# EAGLE design rc_car_v3 (EAGLE 9.3.2)
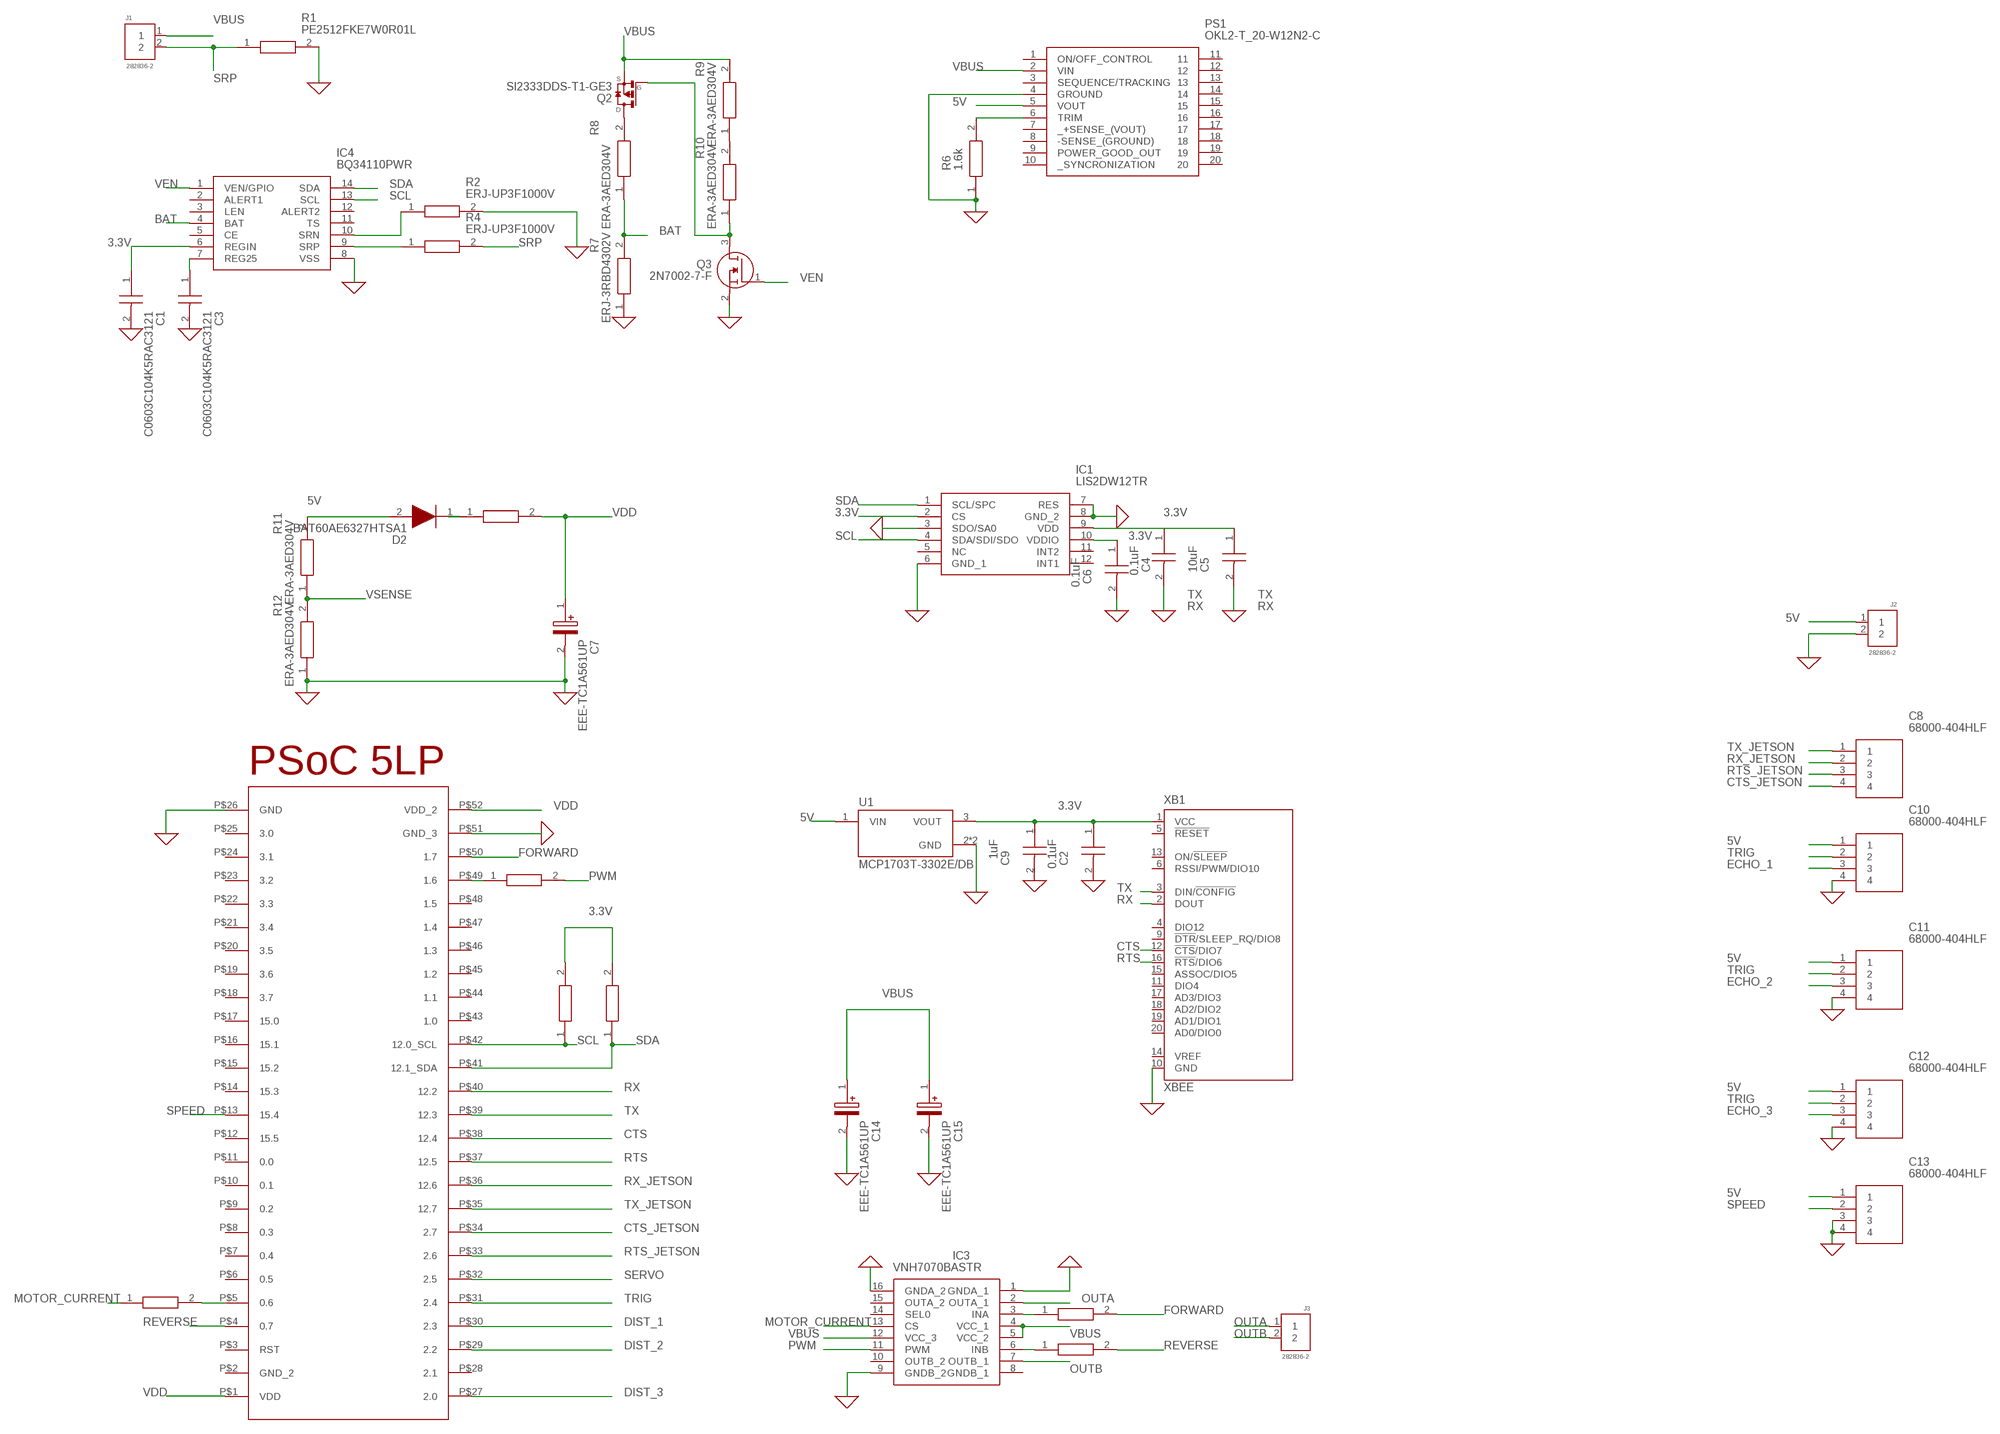
[diagram p0: schematic, sheet 1]

## Parts
C1  C0603C104K5RAC3121  [CAPC1608X95N]
C2  0.1uF  C0603C104K5RAC3121  [CAPC1608X95N]
C3  C0603C104K5RAC3121  [CAPC1608X95N]
C4  0.1uF  C0603C104K5RAC3121  [CAPC1608X95N]
C5  10uF  C0603C104K5RAC3121  [CAPC1608X95N]
C6  0.1uF  C0603C104K5RAC3121  [CAPC1608X95N]
C7  EEE-TC1A561UP  [CAPAE830X1050N]
C8  68000-404HLF  [HDRV4W90P0X254_1X4_1016X241X85]
C9  1uF  C0603C104K5RAC3121  [CAPC1608X95N]
C10  68000-404HLF  [HDRV4W90P0X254_1X4_1016X241X85]
C11  68000-404HLF  [HDRV4W90P0X254_1X4_1016X241X85]
C12  68000-404HLF  [HDRV4W90P0X254_1X4_1016X241X85]
C13  68000-404HLF  [HDRV4W90P0X254_1X4_1016X241X85]
C14  EEE-TC1A561UP  [CAPAE830X1050N]
C15  EEE-TC1A561UP  [CAPAE830X1050N]
D2  BAT60AE6327HTSA1  [SOD2513X110N]
IC1  LIS2DW12TR  [LGA-12]
IC3  VNH7070BASTR  [SOIC127P600X175-16N]
IC4  BQ34110PWR  [SOP65P640X120-14N]
J1  282836-2  [CONN_282836-2]
J2  282836-2  [CONN_282836-2]
J3  282836-2  [CONN_282836-2]
PS1  OKL2-T_20-W12N2-C  [OKL2T20W12N2C]
PSOC1  PSOC_5LP  [PSOC]
Q2  SI2333DDS-T1-GE3  [SOT23]
Q3  2N7002-7-F  [SOT96P240X120-3N]
R1  PE2512FKE7W0R01L  [RESC6432X89N]
R2  ERJ-UP3F1000V  [RESC1608X55N]
R3  1k  ERJ-UP3F1000V  [RESC1608X55N]
R4  ERJ-UP3F1000V  [RESC1608X55N]
R5  1k  ERJ-UP3F1000V  [RESC1608X55N]
R6  1.6k  ERA-3AED304V  [ERA3AEB101V]
R7  ERJ-3RBD4302V  [RESC1608X55N]
R8  ERA-3AED304V  [ERA3AEB101V]
R9  ERA-3AED304V  [ERA3AEB101V]
R10  ERA-3AED304V  [ERA3AEB101V]
R11  ERA-3AED304V  [ERA3AEB101V]
R12  ERA-3AED304V  [ERA3AEB101V]
R13  1k  ERJ-UP3F1000V  [RESC1608X55N]
R14  1k  ERJ-UP3F1000V  [RESC1608X55N]
R15  1k  ERJ-UP3F1000V  [RESC1608X55N]
R16  1k  ERJ-UP3F1000V  [RESC1608X55N]
R17  1k  ERJ-UP3F1000V  [RESC1608X55N]
U1  MCP1703T-3302E/DB  [SOT230P700X180-4N]
XB1  XBEE  [XBEE]

## Nets
0: C1.2 C2.2 C3.2 C4.2 C5.2 C6.2 C7.2(-) C9.2 C10.4 C11.4 C12.4 C13.3 C13.4 C14.2(-) C15.2(-) IC1.3(SDO/SA0) IC1.6(GND_1) IC1.7(RES) IC1.8(GND_2) IC3.1(GNDA_1) IC3.9(GNDB_2) IC3.16(GNDA_2) IC4.8(VSS) PS1.4(GROUND) PSOC1.P$26(GND) PSOC1.P$51(GND_3) Q3.2(S) R1.2 R2.2 R6.1 R7.1 R12.1 U1.2(GND) U1.4(GND) XB1.10(GND) ; supply symbol labelled GND
3.3V: C1.1 C2.1 C4.1 C5.1 C6.1 C9.1 IC1.2(CS) IC1.9(VDD) IC1.10(VDDIO) IC4.6(REGIN) R3.2 R5.2 U1.3(VOUT) XB1.1(VCC)
5V: C10.1 C11.1 C12.1 C13.1 D2.2(A) J2.1 PS1.5(VOUT) R11.2 U1.1(VIN)
BAT: IC4.4(BAT) R7.2 R8.1
CTS: PSOC1.P$38(12.4) XB1.12(!CTS!/DIO7)
CTS_JETSON: C8.4 PSOC1.P$34(2.7)
DIST_1: PSOC1.P$30(2.3)
DIST_2: PSOC1.P$29(2.2)
DIST_3: PSOC1.P$27(2.0)
ECHO_1: C10.3
ECHO_2: C11.3
ECHO_3: C12.3
FORWARD: PSOC1.P$50(1.7) R13.2
MOTOR_CURRENT: IC3.13(CS) R16.1
N$1: PS1.6(TRIM) R6.2
N$2: R9.1 R10.2
N$3: IC4.10(SRN) R2.1
N$4: IC4.9(SRP) R4.1
N$5: C3.1 IC4.7(REG25)
N$6: Q2.3(D) R8.2
N$7: PSOC1.P$49(1.6) R14.1
N$8: Q2.1(G) Q3.3(D) R10.1
N$9: D2.1(K) R17.1
N$10: IC3.3(INA) R13.1
N$11: IC3.6(INB) R15.1
N$13: J2.2 ; supply symbol labelled GND
OUTA: IC3.2(OUTA_1) J3.1
OUTB: IC3.7(OUTB_1) J3.2
PWM: IC3.11(PWM) R14.2
PWM1: PSOC1.P$5(0.6) R16.2
REVERSE: PSOC1.P$4(0.7) R15.2
RTS: PSOC1.P$37(12.5) XB1.16(!RTS!/DIO6)
RTS_JETSON: C8.3 PSOC1.P$33(2.6)
RX: PSOC1.P$40(12.2) XB1.2(DOUT)
RX_JETSON: C8.2 PSOC1.P$36(12.6)
SCL: IC1.4(SDA/SDI/SDO) IC4.13(SCL) PSOC1.P$42(12.0_SCL) R3.1
SDA: IC1.1(SCL/SPC) IC4.14(SDA) PSOC1.P$41(12.1_SDA) R5.1
SERVO: PSOC1.P$32(2.5)
SPEED: C13.2 PSOC1.P$13(15.4)
SRP: J1.2 R1.1 R4.2
TRIG: C10.2 C11.2 C12.2 PSOC1.P$31(2.4)
TX: PSOC1.P$39(12.3) XB1.3(DIN/!CONFIG)
TX_JETSON: C8.1 PSOC1.P$35(12.7)
VBUS: C14.1(+) C15.1(+) IC3.4(VCC_1) IC3.5(VCC_2) IC3.12(VCC_3) J1.1 PS1.2(VIN) Q2.2(S) R9.2
VDD: C7.1(+) PSOC1.P$1(VDD) PSOC1.P$52(VDD_2) R17.2
VEN: IC4.1(VEN/GPIO) Q3.1(G)
VSENSE: R11.1 R12.2
Unconnected: IC1.5(NC) IC1.11(INT2) IC1.12(INT1) IC3.10(OUTB_2) IC3.14(SEL0) IC3.15(OUTA_2) IC4.2(ALERT1) IC4.3(LEN) IC4.5(CE) IC4.11(TS) IC4.12(ALERT2) PS1.1(ON/OFF_CONTROL) PS1.3(SEQUENCE/TRACKING) PS1.7(_+SENSE_(VOUT)) PS1.8(-SENSE_(GROUND)) PS1.9(POWER_GOOD_OUT) PS1.10(_SYNCRONIZATION) PS1.11 PS1.12 PS1.13 PS1.14 PS1.15 PS1.16 PS1.17 PS1.18 PS1.19 PS1.20 PSOC1.P$2(GND_2) PSOC1.P$3(RST) PSOC1.P$6(0.5) PSOC1.P$7(0.4) PSOC1.P$8(0.3) PSOC1.P$9(0.2) PSOC1.P$10(0.1) PSOC1.P$11(0.0) PSOC1.P$12(15.5) PSOC1.P$14(15.3) PSOC1.P$15(15.2) PSOC1.P$16(15.1) PSOC1.P$17(15.0) PSOC1.P$18(3.7) PSOC1.P$19(3.6) PSOC1.P$20(3.5) PSOC1.P$21(3.4) PSOC1.P$22(3.3) PSOC1.P$23(3.2) PSOC1.P$24(3.1) PSOC1.P$25(3.0) PSOC1.P$28(2.1) PSOC1.P$43(1.0) PSOC1.P$44(1.1) PSOC1.P$45(1.2) PSOC1.P$46(1.3) PSOC1.P$47(1.4) PSOC1.P$48(1.5) XB1.4(DIO12) XB1.5(!RESET) XB1.6(RSSI/PWM/DIO10) XB1.9(!DTR!/SLEEP_RQ/DIO8) XB1.11(DIO4) XB1.13(ON/!SLEEP) XB1.14(VREF) XB1.15(ASSOC/DIO5) XB1.17(AD3/DIO3) XB1.18(AD2/DIO2) XB1.19(AD1/DIO1) XB1.20(AD0/DIO0)

## Power pins joined to a net without a drawn wire
GNDB_1: IC3.8(GNDB_1)

## Library data of the parts
C1-C6 C9 = SamacSys_Parts:C0603C104K5RAC3121: Multilayer Ceramic Capacitors MLCC - SMD/SMT 50V .1uF X7R 0603 10% AEC-Q200 Source: Datasheet; DESCRIPTION: Multilayer Ceramic Capacitors MLCC - SMD/SMT 50V .1uF X7R 0603 10% AEC-Q200; HEIGHT: 0.95mm; MANUFACTURER_NAME: Kemet; MANUFACTURER_PART_NUMBER: C0603C104K5RAC3121; MOUSER_PART_NUMBER: 80-C603C104K5RAC3121; MOUSER_PRICE-STOCK: https://www.mouser.co.uk/ProductDetail/KEMET/C0603C104K5RAC3121?qs=oBCMsStVSxe1EkGyoyETtg%3D%3D
C7 C14 C15 = SamacSys_Parts:EEE-TC1A561UP: Cap Aluminum Lytic 560uF 10V 20% (8 X 10.2mm) SMD 0.2 Ohm 410mA 3000h 125C T/R Source: Datasheet <https://www.arrow.com/en/products/eee-tc1a561up/panasonic>; DESCRIPTION: Cap Aluminum Lytic 560uF 10V 20% (8 X 10.2mm) SMD 0.2 Ohm 410mA 3000h 125C T/R; HEIGHT: 10.5mm; MANUFACTURER_NAME: Panasonic; MANUFACTURER_PART_NUMBER: EEE-TC1A561UP
C8 C10-C13 = SamacSys_Parts:68000-404HLF: 4 Positions Header Connector 0.100" (2.54mm) Through Hole Tin Source: Datasheet <http://www.amphenol-icc.com/bergstik-68000404hlf.html>; DESCRIPTION: 4 Positions Header Connector 0.100" (2.54mm) Through Hole Tin; HEIGHT: 8.58mm; MANUFACTURER_NAME: Amphenol; MANUFACTURER_PART_NUMBER: 68000-404HLF; MOUSER_PART_NUMBER: 649-68000-404HLF; MOUSER_PRICE-STOCK: https://www.mouser.co.uk/ProductDetail/Amphenol-FCI/68000-404HLF?qs=p7Li5uGGkArjDZZRBMcFJQ%3D%3D
D2 = SamacSys_Parts:BAT60AE6327HTSA1: INFINEON - BAT60AE6327HTSA1 - RECTIFIER, SCHOTTKY, 3A, 10V, SOD-323 Source: Datasheet <https://www.infineon.com/dgdl/Infineon-BAT60ASERIES-DS-v01_01-en.pdf?fileId=db3a304313d846880113def70c9304a9>; DESCRIPTION: INFINEON - BAT60AE6327HTSA1 - RECTIFIER, SCHOTTKY, 3A, 10V, SOD-323; HEIGHT: 1.1mm; MANUFACTURER_NAME: Infineon; MANUFACTURER_PART_NUMBER: BAT60AE6327HTSA1; MOUSER_PART_NUMBER: 726-BAT60AE6327HTSA1; MOUSER_PRICE-STOCK: https://www.mouser.co.uk/ProductDetail/Infineon-Technologies/BAT60AE6327HTSA1?qs=OwbwYO03UsIW3Y2lCXbs8Q%3D%3D
IC1 = SamacSys_Parts:LIS2DW12TR: Accelerometers MEMS digital output motion sensor:high-performance ultra-low-power 3-axis "femto" accelerometer Source: Datasheet <http://www.st.com/content/ccc/resource/technical/document/datasheet/group3/30/3a/4e/6b/68/16/4a/35/DM00323179/files/DM00323179.pdf/jcr:content/translations/en.DM00323179.pdf>; DESCRIPTION: Accelerometers MEMS digital output motion sensor:high-performance ultra-low-power 3-axis "femto" accelerometer; HEIGHT: mm; MANUFACTURER_NAME: STMicroelectronics; MANUFACTURER_PART_NUMBER: LIS2DW12TR; MOUSER_PART_NUMBER: 511-LIS2DW12TR; MOUSER_PRICE-STOCK: https://www.mouser.co.uk/ProductDetail/STMicroelectronics/LIS2DW12TR?qs=u4fy%2FsgLU9NZAt0DqrAehA%3D%3D
IC3 = SamacSys_Parts:VNH7070BASTR: Motor / Motion / Ignition Controllers & Drivers Automotive fully integrated H-bridge motor driver Source: Datasheet <https://rs.componentsearchengine.com/Datasheets/1/VNH7070BASTR.pdf>; DESCRIPTION: Motor / Motion / Ignition Controllers & Drivers Automotive fully integrated H-bridge motor driver; HEIGHT: 1.75mm; MANUFACTURER_NAME: STMicroelectronics; MANUFACTURER_PART_NUMBER: VNH7070BASTR; MOUSER_PART_NUMBER: 511-VNH7070BASTR; MOUSER_PRICE-STOCK: https://www.mouser.co.uk/ProductDetail/STMicroelectronics/VNH7070BASTR?qs=5aG0NVq1C4zvEdklLjnXpw%3D%3D
IC4 = SamacSys_Parts:BQ34110PWR: Battery Management Multi-Chemistry High-cell Count Battery Fuel Gauge w/Integrated Rarely Discharged Module 14-TSSOP -40 to 85 Source: Datasheet <http://www.ti.com/lit/ds/symlink/bq34110.pdf>; DESCRIPTION: Battery Management Multi-Chemistry High-cell Count Battery Fuel Gauge w/Integrated Rarely Discharged Module 14-TSSOP -40 to 85; HEIGHT: 1.2mm; MANUFACTURER_NAME: Texas Instruments; MANUFACTURER_PART_NUMBER: BQ34110PWR; MOUSER_PART_NUMBER: 595-BQ34110PWR; MOUSER_PRICE-STOCK: https://www.mouser.co.uk/ProductDetail/Texas-Instruments/BQ34110PWR/?qs=OEYMhS7p3YZgyjlwqO1X6Q%3D%3D
J1-J3 = 282836-2:282836-2: TERM BLOCK 2POS SIDE ENTRY 5MM Check prices <https://pricing.snapeda.com/parts/282836-2/TE%20Connectivity/view-part?ref=eda>; AVAILABILITY: In Stock; CENTERLINE_PITCH: 5 mm[.197 in]; COMMENT: 282836-2; DESCRIPTION: Connector, Terminal Block; Wire Receptacle; 2 Pos.; 16-30 AWG; 0.197 in. CL; Sid; EU_ROHS_COMPLIANCE: Compliant with Exemptions; MF: TE Connectivity; MP: 282836-2; NUMBER_OF_POSITIONS: 2; PACKAGE: None; PRICE: None; PURCHASE-URL: https://pricing.snapeda.com/search/part/282836-2/?ref=eda
PS1 = SamacSys_Parts:OKL2-T_20-W12N2-C: MURATA POWER SOLUTIONS - OKL2-T/20-W12N2-C - DC-DC CONVERTER, NON ISO POL, 1O/P, 100W, 20A Source: Datasheet <https://power.murata.com/pub/data/power/okl2-t20-w12.pdf>; DESCRIPTION: MURATA POWER SOLUTIONS - OKL2-T/20-W12N2-C - DC-DC CONVERTER, NON ISO POL, 1O/P, 100W, 20A; HEIGHT: 8.75mm; MANUFACTURER_NAME: Murata Electronics; MANUFACTURER_PART_NUMBER: OKL2-T/20-W12N2-C; MOUSER_PART_NUMBER: 580-OKL2-T/20-W12N2C; MOUSER_PRICE-STOCK: https://www.mouser.co.uk/ProductDetail/Murata-Power-Solutions/OKL2-T-20-W12N2-C?qs=ij065CdJUyFd%2FXdiJKa4hg%3D%3D
PSOC1 = PSoC 5LP:PSOC_5LP
Q2 = SI2333DDS-T1-GE3:SI2333DDS-T1-GE3: P-Channel MOSFET Check prices <https://pricing.snapeda.com/parts/SI2333DDS-T1-GE3/Vishay%20Siliconix/view-part?ref=eda>; AVAILABILITY: Not in stock; DESCRIPTION: P-Channel 12V 6A (Tc) 1.2W (Ta), 1.7W (Tc) Surface Mount SOT-23-3 (TO-236); MF: Vishay Siliconix; MP: SI2333DDS-T1-GE3; PACKAGE: SOT-23-3 Vishay Siliconix; PRICE: None
Q3 = SamacSys_Parts:2N7002-7-F: MOSFET N-Channel 60V 0.21A SOT23 Diodes Inc 2N7002-7-F N-channel MOSFET Transistor, 0.115 A, 60 V, 3-Pin SOT-23 Source: Datasheet <http://diodes.com/datasheets/ds11303.pdf>; DESCRIPTION: MOSFET N-Channel 60V 0.21A SOT23 Diodes Inc 2N7002-7-F N-channel MOSFET Transistor, 0.115 A, 60 V, 3-Pin SOT-23; HEIGHT: 1.2mm; MANUFACTURER_NAME: Diodes Inc.; MANUFACTURER_PART_NUMBER: 2N7002-7-F; MOUSER_PART_NUMBER: 621-2N7002-F; MOUSER_PRICE-STOCK: https://www.mouser.co.uk/ProductDetail/Diodes-Incorporated/2N7002-7-F?qs=jMXWnm70%252BC%252BAX%252BMLzUkTZg%3D%3D
R1 = SamacSys_Parts:PE2512FKE7W0R01L: Current Sense Resistors - SMD 2512 Case 10 mOhm AEC-Q200 Source: Datasheet <http://www.yageo.com/documents/recent/PYu-PE_521_RoHS_L_5.pdf>; DESCRIPTION: Current Sense Resistors - SMD 2512 Case 10 mOhm AEC-Q200; HEIGHT: 0.89mm; MANUFACTURER_NAME: YAGEO (PHYCOMP); MANUFACTURER_PART_NUMBER: PE2512FKE7W0R01L; MOUSER_PART_NUMBER: 603-PE2512FKE7W0R01L; MOUSER_PRICE-STOCK: https://www.mouser.co.uk/ProductDetail/Yageo/PE2512FKE7W0R01L/?qs=tggtontpCXNmX62CEk4w1Q%3D%3D
R2-R5 R13-R17 = SamacSys_Parts:ERJ-UP3F1000V: Thick Film Resistors - SMD 0603 0.25W 1% 100ohm AEC-Q200 Source: Datasheet; DESCRIPTION: Thick Film Resistors - SMD 0603 0.25W 1% 100ohm AEC-Q200; HEIGHT: 0.55mm; MANUFACTURER_NAME: Panasonic; MANUFACTURER_PART_NUMBER: ERJ-UP3F1000V; MOUSER_PART_NUMBER: 667-ERJ-UP3F1000V; MOUSER_PRICE-STOCK: https://www.mouser.co.uk/ProductDetail/Panasonic/ERJ-UP3F1000V/?qs=GedFDFLaBXHy632EhqzO5A%3D%3D
R6 R8-R12 = SamacSys_Parts:ERA-3AED304V: Thin Film Resistors - SMD 0603 300Kohms 25ppm 0.5% AEC-Q200 Source: Datasheet <https://industrial.panasonic.com/cdbs/www-data/pdf/RDM0000/AOA0000C307.pdf>; DESCRIPTION: Thin Film Resistors - SMD 0603 300Kohms 25ppm 0.5% AEC-Q200; HEIGHT: 0.55mm; MANUFACTURER_NAME: Panasonic; MANUFACTURER_PART_NUMBER: ERA-3AED304V; MOUSER_PART_NUMBER: 667-ERA-3AED304V; MOUSER_PRICE-STOCK: https://www.mouser.co.uk/ProductDetail/Panasonic/ERA-3AED304V?qs=MNPzkKEzRtTKYZira3Pinw%3D%3D
R7 = SamacSys_Parts:ERJ-3RBD4302V: ERJ3R Resistor,0.1W,43k Ohms,0.5% Panasonic Thick Film Surface Mount Resistor 0603 Case 43k +/-0.5% 0.1W +/-50ppm/C Source: Datasheet <https://componentsearchengine.com/Datasheets/1/ERJ-3RBD4302V.pdf>; DESCRIPTION: ERJ3R Resistor,0.1W,43k Ohms,0.5% Panasonic Thick Film Surface Mount Resistor 0603 Case 43k +/-0.5% 0.1W +/-50ppm/C; HEIGHT: 0.55mm; MANUFACTURER_NAME: Panasonic; MANUFACTURER_PART_NUMBER: ERJ-3RBD4302V; MOUSER_PART_NUMBER: 667-ERJ-3RBD4302V; MOUSER_PRICE-STOCK: https://www.mouser.com/Search/Refine.aspx?Keyword=667-ERJ-3RBD4302V
U1 = MCP1703T-3302E_DB:MCP1703T-3302E/DB: MCP1703T-3302E/DB, LDOVoltage Regulator, 200mA, 3.3V, 2.7 to 16Vin, 3+Tab-Pin SOT-223 Check prices <https://pricing.snapeda.com/parts/MCP1703T-3302E/DB/Microchip%20Technology/view-part?ref=eda>; AVAILABILITY: No availability data; DESCRIPTION: Linear Voltage Regulator IC Positive Fixed 1 Output 250mA SOT-223-3; MF: Microchip Technology; MP: MCP1703T-3302E/DB; PACKAGE: SOT-223 Microchip; PRICE: None
XB1 = xbee:XBEE: XBee (TM) /XBee-PRO(TM) OEM RF Modules Source: MaxStream, Inc. xbee_productmanual.pdf; MPN: XBP24-Z7UIT-004; OC_FARNELL: 1751799; OC_NEWARK: 34R5507

## Board
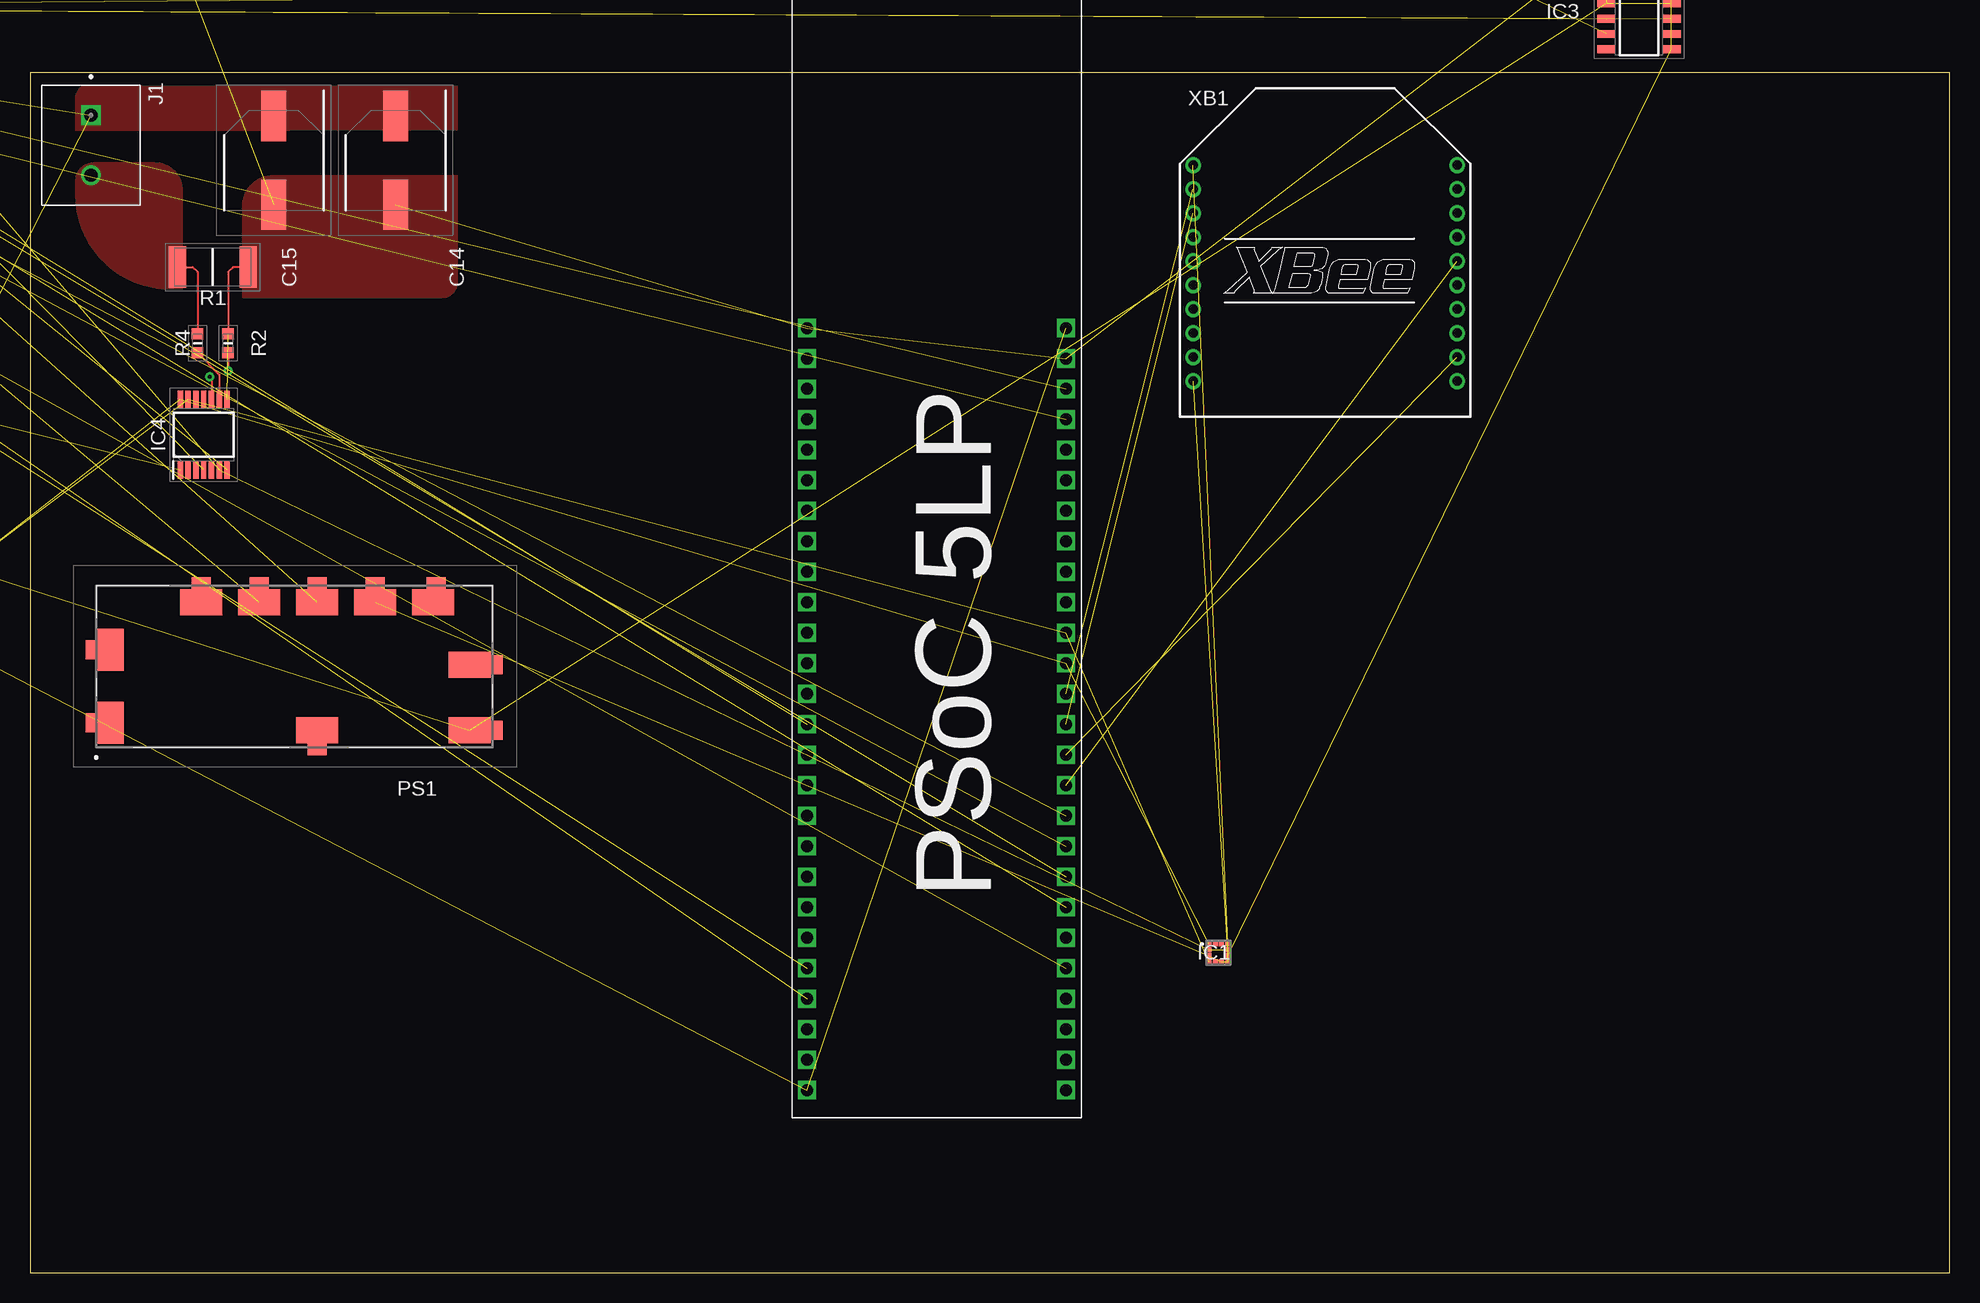
[diagram p1: board, top side]
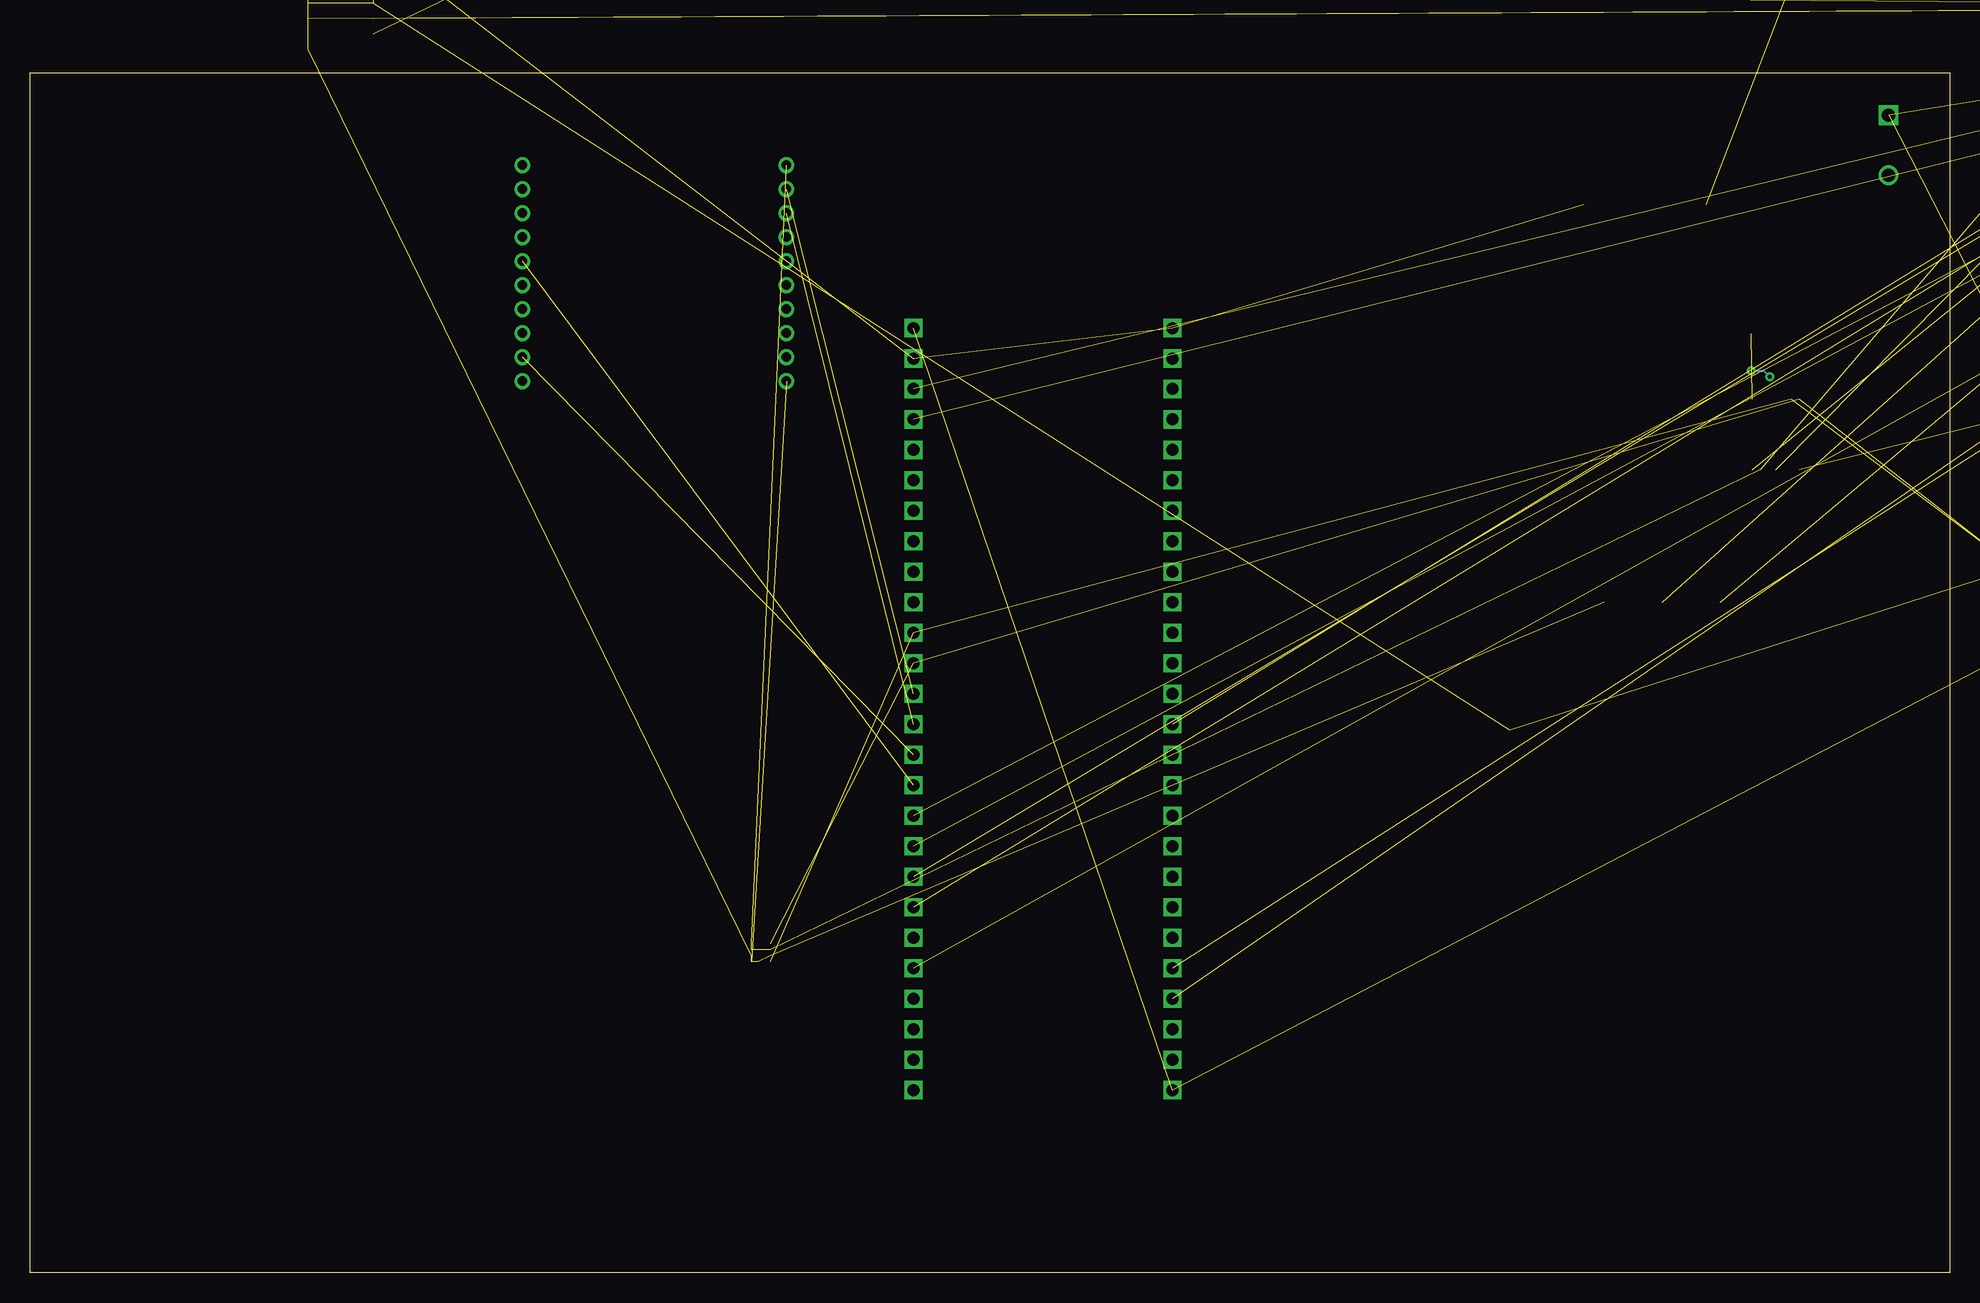
[diagram p2: board, bottom side, seen from below]

Size 160 x 100 mm. Coordinates in mm from the lower left corner, seen from the top.
Outline: 0,0 160,0 160,100 0,100 0,0
Copper layers (1*16): Top 0.035mm / dielectric 1.5mm / Bottom 0.035mm
Design rules "default": minimum track width 6mil, minimum drill 0.35mm, track to track 6mil, track to pad 6mil, pad to pad 6mil, via to via 6mil, smd to smd 6mil, copper to edge 40mil, drill to drill 6mil, minimum pad ring 10mil, minimum via ring 8mil, stop-mask expansion 4mil, vias tented up to drill 0mil, thermal gap 10mil

### Footprints (pad centres in the part's own frame; a part is rotated, then mirrored left to right if it is on the bottom)
CAPC1608X95N = smd 0.78 x 0.98: 1 -0.7,0; 2 0.7,0
CAPAE830X1050N = smd 4.2 x 2.1: 1 -3.7,0; 2 3.7,0
HDRV4W90P0X254_1X4_1016X241X85 = drill 1.1 pad 1.65 square: 1 0,0 | drill 1.1 pad 1.65: 2 2.54,0; 3 5.08,0; 4 7.62,0
SOD2513X110N = smd 1.05 x 0.5: 1 -1.138,0; 2 1.138,0
LGA-12 = smd 0.4 x 0.4: 1 -0.8,0.75; 2 -0.8,0.25; 3 -0.8,-0.25; 4 -0.8,-0.75; 5 -0.25,-0.75; 6 0.25,-0.75; 7 0.8,-0.75; 8 0.8,-0.25; 9 0.8,0.25; 10 0.8,0.75; 11 0.25,0.75; 12 -0.25,0.75
SOIC127P600X175-16N = smd 1.525 x 0.65: 1 -2.712,4.445; 2 -2.712,3.175; 3 -2.712,1.905; 4 -2.712,0.635; 5 -2.712,-0.635; 6 -2.712,-1.905; 7 -2.712,-3.175; 8 -2.712,-4.445; 9 2.712,-4.445; 10 2.712,-3.175; 11 2.712,-1.905; 12 2.712,-0.635; 13 2.712,0.635; 14 2.712,1.905; 15 2.712,3.175; 16 2.712,4.445
SOP65P640X120-14N = smd 1.475 x 0.45: 1 -2.938,1.95; 2 -2.938,1.3; 3 -2.938,0.65; 4 -2.938,0; 5 -2.938,-0.65; 6 -2.938,-1.3; 7 -2.938,-1.95; 8 2.938,-1.95; 9 2.938,-1.3; 10 2.938,-0.65; 11 2.938,0; 12 2.938,0.65; 13 2.938,1.3; 14 2.938,1.95
CONN_282836-2 = drill 1.1 square: 1 -2.5,0 | drill 1.1: 2 2.5,0
OKL2T20W12N2C = smd 2.18 x 3.5: 1 -15.355,-4.695; 8 -15.355,1.395 | smd 3.5 x 2.18: 2 14.545,-5.335; 3 11.495,5.335; 4 6.665,5.335; 5 1.845,5.335; 6 -2.985,5.335; 7 -7.815,5.335; 9 1.845,-5.335; 10 14.545,0.125 | smd 1 x 1.6: 11 -16.945,-4.695; 12 16.795,-5.335; 18 -16.945,1.395; 20 16.795,0.125 | smd 1.6 x 1: 13 11.745,6.925; 14 6.665,6.925; 15 1.845,6.925; 16 -2.985,6.925; 17 -7.815,6.925; 19 1.845,-6.925
PSOC = drill 1 square: P$1 95.25,1.27; P$2 92.71,1.27; P$3 90.17,1.27; P$4 87.63,1.27; P$5 85.09,1.27; P$6 82.55,1.27; P$7 80.01,1.27; P$8 77.47,1.27; P$9 74.93,1.27; P$10 72.39,1.27; P$11 69.85,1.27; P$12 67.31,1.27; P$13 64.77,1.27; P$14 62.23,1.27; P$15 59.69,1.27; P$16 57.15,1.27; P$17 54.61,1.27; P$18 52.07,1.27; P$19 49.53,1.27; P$20 46.99,1.27; P$21 44.45,1.27; P$22 41.91,1.27; P$23 39.37,1.27; P$24 36.83,1.27; P$25 34.29,1.27; P$26 31.75,1.27; P$27 95.25,22.86; P$28 92.71,22.86; P$29 90.17,22.86; P$30 87.63,22.86; P$31 85.09,22.86; P$32 82.55,22.86; P$33 80.01,22.86; P$34 77.47,22.86; P$35 74.93,22.86; P$36 72.39,22.86; P$37 69.85,22.86; P$38 67.31,22.86; P$39 64.77,22.86; P$40 62.23,22.86; P$41 59.69,22.86; P$42 57.15,22.86; P$43 54.61,22.86; P$44 52.07,22.86; P$45 49.53,22.86; P$46 46.99,22.86; P$47 44.45,22.86; P$48 41.91,22.86; P$49 39.37,22.86; P$50 36.83,22.86; P$51 34.29,22.86; P$52 31.75,22.86
SOT23 = smd 1 x 1.4: 1 -0.95,-1.1; 2 0.95,-1.1; 3 0,1.1
SOT96P240X120-3N = smd 1.2 x 0.65: 1 -1.05,0.96; 2 -1.05,-0.96; 3 1.05,0
RESC6432X89N = smd 1.45 x 3.45: 1 -2.95,0; 2 2.95,0
RESC1608X55N = smd 0.9 x 0.95: 1 -0.8,0; 2 0.8,0
ERA3AEB101V = smd 0.65 x 0.9: 1 -0.725,0; 2 0.725,0
SOT230P700X180-4N = smd 1.76 x 0.92: 1 -3.125,2.3; 2 -3.125,0; 3 -3.125,-2.3 | smd 1.76 x 3.19: 4 3.125,0
XBEE = drill 0.8 pad 1.27: 1 -11,9; 2 -11,7; 3 -11,5; 4 -11,3; 5 -11,1; 6 -11,-1; 7 -11,-3; 8 -11,-5; 9 -11,-7; 10 -11,-9; 11 11,-9; 12 11,-7; 13 11,-5; 14 11,-3; 15 11,-1; 16 11,1; 17 11,3; 18 11,5; 19 11,7; 20 11,9

### Placement (x,y rotation side)
C1  -72.39,96.52 0 top  (outside the outline)
C2  -16.51,105.41 0 top  (outside the outline)
C3  -24.13,100.33 0 top  (outside the outline)
C4  -22.86,105.41 0 top  (outside the outline)
C5  -35.56,105.41 0 top  (outside the outline)
C6  -29.21,105.41 0 top  (outside the outline)
C7  -55.88,80.01 0 top  (outside the outline)
C8  -22.86,93.98 0 top  (outside the outline)
C9  -71.12,105.41 0 top  (outside the outline)
C10  -39.37,93.98 0 top  (outside the outline)
C11  -55.88,93.98 0 top  (outside the outline)
C12  -72.39,93.98 0 top  (outside the outline)
C13  -22.86,97.79 0 top  (outside the outline)
C14  30.48,92.71 270 top
C15  20.32,92.71 270 top
D2  -39.37,97.79 0 top  (outside the outline)
IC1  99.06,26.67 0 top
IC3  134.11,106.43 0 top
IC4  14.48,69.85 90 top
J1  5.08,93.98 270 top
J2  -67.31,64.77 0 top  (outside the outline)
J3  55.88,137.16 90 top  (outside the outline)
PS1  22.1,50.55 0 top
PSOC1  63.5,110.49 270 top
Q2  -13.97,62.23 0 top  (outside the outline)
Q3  -78.74,88.9 0 top  (outside the outline)
R1  15.24,83.82 0 top
R2  16.51,77.47 90 top
R3  -84.58,-1.27 0 top  (outside the outline)
R4  13.97,77.47 90 top
R5  -84.58,-3.56 0 top  (outside the outline)
R6  -40.64,105.41 0 top  (outside the outline)
R7  -43.18,100.33 0 top  (outside the outline)
R8  -20.32,102.87 0 top  (outside the outline)
R9  -35.56,102.87 0 top  (outside the outline)
R10  -50.8,102.87 0 top  (outside the outline)
R11  -66.04,102.87 0 top  (outside the outline)
R12  -81.28,102.87 0 top  (outside the outline)
R13  -45.72,105.41 0 top  (outside the outline)
R14  -50.8,105.41 0 top  (outside the outline)
R15  -55.88,105.41 0 top  (outside the outline)
R16  -60.96,105.41 0 top  (outside the outline)
R17  -66.04,105.41 0 top  (outside the outline)
U1  5.08,120.65 0 top  (outside the outline)
XB1  107.95,83.31 0 top

### Tracks (layer width: path | path; a pad name or v marks a point on that pad's centre or on a via)
0  (31 unrouted)
  Top 0.152: R1.2 16.92,83.82 16.51,83.41 R2.2
  pour Top (no thermals): 17.78,85.09 17.78,88.9 arc-90 20.32,91.44 21.59,91.44 35.56,91.44 35.56,82.55 arc-90 34.29,81.28 20.32,81.28 17.78,81.28
3.3V  (13 unrouted)
5V  (8 unrouted)
BAT  (2 unrouted)
CTS  (1 unrouted)
CTS_JETSON  (1 unrouted)
FORWARD  (1 unrouted)
MOTOR_CURRENT  (1 unrouted)
N$1  (1 unrouted)
N$2  (1 unrouted)
N$3  (via drill 0.35)
  Top 0.152: R2.1 v16.51,75.18 | v14.99,74.68 15.13,74.53 IC4.10
  Bottom 0.152: v16.51,75.18 15.49,75.18 v14.99,74.68
N$4
  Top 0.152: 14,76.64 R4.1 15.78,74.86 IC4.9
N$5  (1 unrouted)
N$6  (1 unrouted)
N$7  (1 unrouted)
N$8  (2 unrouted)
N$9  (1 unrouted)
N$10  (1 unrouted)
N$11  (1 unrouted)
OUTA  (1 unrouted)
OUTB  (1 unrouted)
PWM  (1 unrouted)
PWM1  (1 unrouted)
REVERSE  (1 unrouted)
RTS  (1 unrouted)
RTS_JETSON  (1 unrouted)
RX  (1 unrouted)
RX_JETSON  (1 unrouted)
SCL  (3 unrouted)
SDA  (3 unrouted)
SPEED  (1 unrouted)
SRP
  Top 0.152: R1.1 13.56,83.82 13.97,83.41 R4.2
  pour Top (no thermals): 5.33,92.46 arc90 3.81,90.93 3.81,89.92 arc90 11.68,82.04 12.7,82.04 12.7,90.17 arc90 10.41,92.46
TRIG  (3 unrouted)
TX  (1 unrouted)
TX_JETSON  (1 unrouted)
VBUS  (6 unrouted)
  pour Top (no thermals): 3.81,96.52 3.81,95.25 21.59,95.25 21.59,97.79 arc90 20.32,99.06 11.43,99.06 6.35,99.06 5.08,99.06 arc90 3.81,97.79
  pour Top (no thermals): 20.32,99.06 35.56,99.06 35.56,95.25 20.32,95.25
VDD  (3 unrouted)
VEN  (1 unrouted)
VSENSE  (1 unrouted)